# EAGLE design Actuator-MKI-2 (EAGLE 9.6.2)

## Sheet 1 of 2: Part Schematics
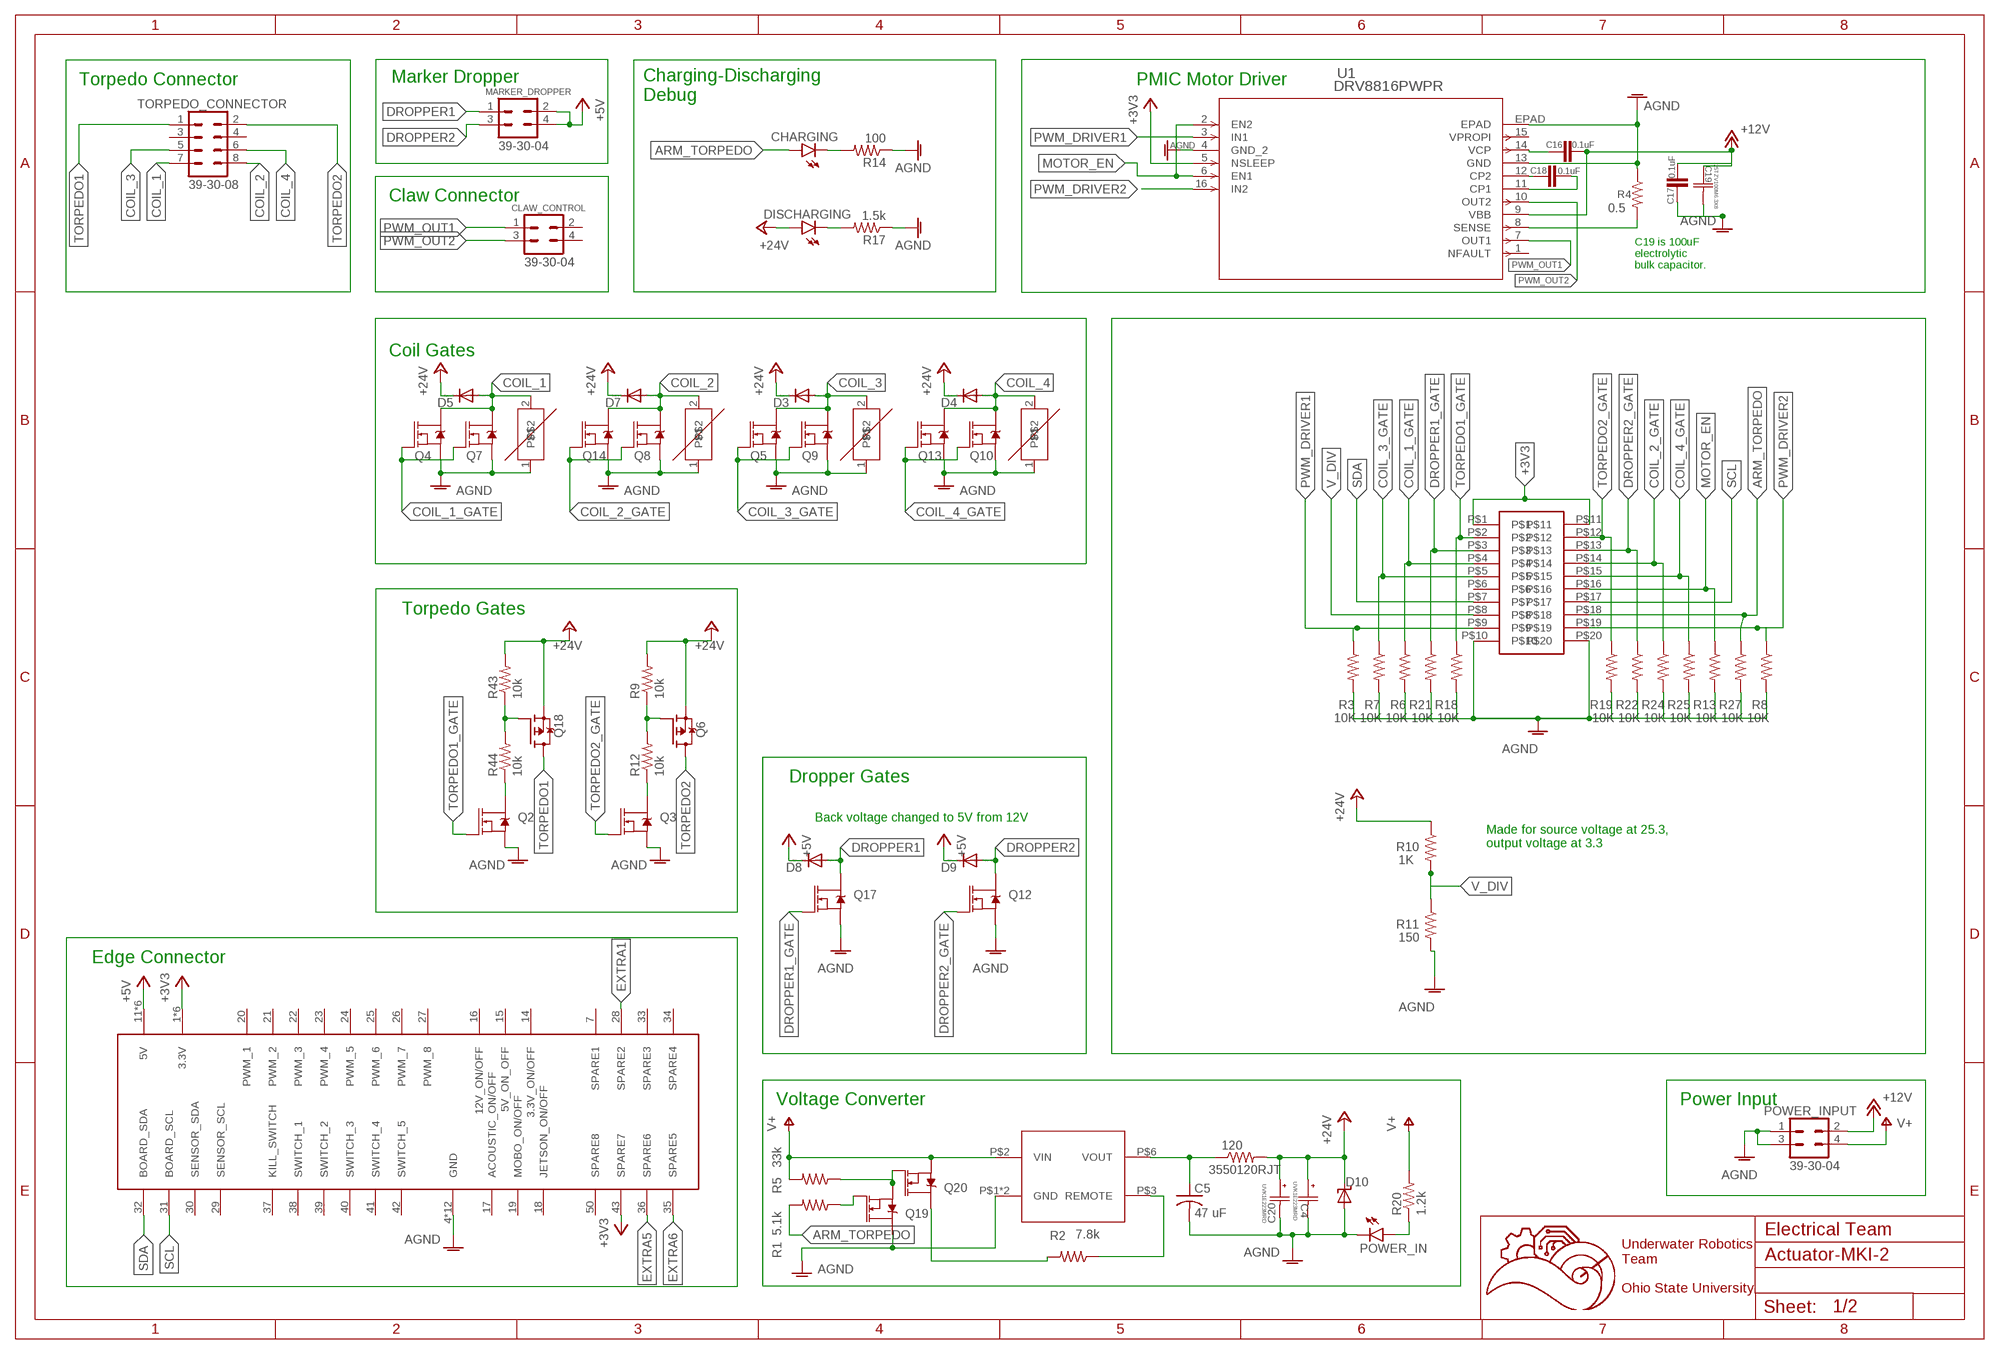
[diagram p0: schematic, sheet 1]

### Parts
120  3550120RJT  [3550120RJT]
C4  UVK1E223MRD  [CAP_UFW_25X50_NCH]
C5  47 uF  C-USC1206K  [C1206K]
C16  0.1uF  C-EUC0603  [C0603]
C17  0.1uF  C-EUC0603  [C0603]
C18  0.1uF  C-EUC0603  [C0603]
C19  25TZV100M6.3X8  [CAP_J-V_6P3X8_RUB]
C20  UVK1E223MRD  [CAP_UFW_25X50_NCH]
CHARGING  LEDCHIPLED_0603  [CHIPLED_0603]
CLAW_CONTROL  39-30-04  [39-30-?04?]
D3  DIODE-SMB  [SMB]
D4  DIODE-SMB  [SMB]
D5  DIODE-SMB  [SMB]
D7  DIODE-SMB  [SMB]
D8  DIODE-SMB  [SMB]
D9  DIODE-SMB  [SMB]
D10  SUPPRESSOR-SMBJ  [SMBJ]
DISCHARGING  LEDCHIPLED_0603  [CHIPLED_0603]
MARKER_DROPPER  39-30-04  [39-30-?04?]
POWER_IN  LEDCHIPLED_0603  [CHIPLED_0603]
POWER_INPUT  39-30-04  [39-30-?04?]
Q2  MOSFET-NCH-AO3404A  [SOT23-3]
Q3  MOSFET-NCH-AO3404A  [SOT23-3]
Q4  MOSFET-NCH-AO3404A  [SOT23-3]
Q5  MOSFET-NCH-AO3404A  [SOT23-3]
Q6  FDD4141TO252  [TO252]
Q7  MOSFET-NCH-AO3404A  [SOT23-3]
Q8  MOSFET-NCH-AO3404A  [SOT23-3]
Q9  MOSFET-NCH-AO3404A  [SOT23-3]
Q10  MOSFET-NCH-AO3404A  [SOT23-3]
Q12  MOSFET-NCH-AO3404A  [SOT23-3]
Q13  MOSFET-NCH-AO3404A  [SOT23-3]
Q14  MOSFET-NCH-AO3404A  [SOT23-3]
Q17  MOSFET-NCH-AO3404A  [SOT23-3]
Q18  FDD4141TO252  [TO252]
Q19  MOSFET-NCH-AO3404A  [SOT23-3]
Q20  MOSFET-NCH-AO3404A  [SOT23-3]
R1  5.1k  R-US_R0603  [R0603]
R2  7.8k  R-US_R0603  [R0603]
R3  10K  R-US_R0603  [R0603]
R4  0.5  R-US_R0805  [R0805]
R5  33k  R-US_R0603  [R0603]
R6  10K  R-US_R0603  [R0603]
R7  10K  R-US_R0603  [R0603]
R8  10K  R-US_R0603  [R0603]
R9  10k  R-US_R0603  [R0603]
R10  1K  R-US_R0603  [R0603]
R11  150  R-US_R0603  [R0603]
R12  10k  R-US_R0603  [R0603]
R13  10K  R-US_R0603  [R0603]
R14  100  R-US_R0805  [R0805]
R17  1.5k  R-US_R0805  [R0805]
R18  10K  R-US_R0603  [R0603]
R19  10K  R-US_R0603  [R0603]
R20  1.2k  R-US_R0805  [R0805]
R21  10K  R-US_R0603  [R0603]
R22  10K  R-US_R0603  [R0603]
R24  10K  R-US_R0603  [R0603]
R25  10K  R-US_R0603  [R0603]
R27  10K  R-US_R0603  [R0603]
R43  10k  R-US_R0603  [R0603]
R44  10k  R-US_R0603  [R0603]
TORPEDO_CONNECTOR  39-30-08  [39-30-?08?]
U1  DRV8816PWPR  [PWP_16]
U$1  5530843-EDGE  [5530843-6-BOARDFINGERS]
U$4  ERZ-VF2M270ERZ-VF2M270  [RESM8060X320N]
U$5  ERZ-VF2M270ERZ-VF2M270  [RESM8060X320N]
U$6  TMR6-2415  [TMR6-2415]
U$7  ERZ-VF2M270ERZ-VF2M270  [RESM8060X320N]
U$8  ERZ-VF2M270ERZ-VF2M270  [RESM8060X320N]
U$9  JTAG-SMD  [JTAG-SMD]

### Nets
+3V3: U1.5(NSLEEP) U$1.1(3.3V) U$1.2(3.3V) U$1.3(3.3V) U$1.43(SPARE7) U$1.54(3.3V) U$1.55(3.3V) U$1.56(3.3V) U$9.P$1 U$9.P$11
+5V: D8.C D9.C MARKER_DROPPER.2 MARKER_DROPPER.4 U$1.11(5V) U$1.12(5V) U$1.13(5V) U$1.44(5V) U$1.45(5V) U$1.46(5V)
+12V: C16.2 C17.2 C19.1 POWER_INPUT.2 U1.9(VBB)
+24V: 120.P$2 C4.1 C20.1 D3.C D4.C D5.C D7.C D10.C DISCHARGING.A Q6.2(S) Q18.2(S) R9.2 R10.1 R43.2
AGND: C4.2 C5.2 C17.1 C19.2 C20.2 D10.A POWER_IN.C POWER_INPUT.1 POWER_INPUT.3 Q2.2(S) Q3.2(S) Q4.2(S) Q5.2(S) Q7.2(S) Q8.2(S) Q9.2(S) Q10.2(S) Q12.2(S) Q13.2(S) Q14.2(S) Q17.2(S) Q19.3(D) R3.2 R4.1 R6.2 R7.2 R8.2 R11.2 R13.2 R14.1 R17.1 R18.2 R19.2 R21.2 R22.2 R24.2 R25.2 R27.2 U1.4(GND_2) U1.13(GND) U1.EPAD U$1.4(GND) U$1.5(GND) U$1.6(GND) U$1.8(GND) U$1.9(GND) U$1.10(GND) U$1.47(GND) U$1.48(GND) U$1.49(GND) U$1.51(GND) U$1.52(GND) U$1.53(GND) U$4.1 U$5.1 U$6.P$1(GND) U$6.P$7(GND) U$7.1 U$8.1 U$9.P$10 U$9.P$20
ARM_TORPEDO: CHARGING.A R1.2 R27.1 U$9.P$18
COIL_1: D5.A Q4.3(D) Q7.3(D) TORPEDO_CONNECTOR.7 U$8.2
COIL_1_GATE: Q4.1(G) Q7.1(G) R6.1 U$9.P$4
COIL_2: D7.A Q8.3(D) Q14.3(D) TORPEDO_CONNECTOR.8 U$7.2
COIL_2_GATE: Q8.1(G) Q14.1(G) R24.1 U$9.P$14
COIL_3: D3.A Q5.3(D) Q9.3(D) TORPEDO_CONNECTOR.5 U$5.2
COIL_3_GATE: Q5.1(G) Q9.1(G) R7.1 U$9.P$5
COIL_4: D4.A Q10.3(D) Q13.3(D) TORPEDO_CONNECTOR.6 U$4.2
COIL_4_GATE: Q10.1(G) Q13.1(G) R25.1 U$9.P$15
DROPPER1: D8.A MARKER_DROPPER.1 Q17.3(D)
DROPPER1_GATE: Q17.1(G) R21.1 U$9.P$3
DROPPER2: D9.A MARKER_DROPPER.3 Q12.3(D)
DROPPER2_GATE: Q12.1(G) R22.1 U$9.P$13
EXTRA1: U$1.28(SPARE2)
EXTRA5: U$1.36(SPARE6)
EXTRA6: U$1.35(SPARE5)
MOTOR_EN: R13.1 U1.2(EN2) U1.6(EN1) U$9.P$16
N$2: C16.1 U1.14(VCP)
N$3: R2.1 U$6.P$3(REMOTE)
N$4: CHARGING.C R14.2
N$5: Q19.1(G) R1.1
N$6: Q19.2(S) Q20.1(G) R5.1
N$7: Q20.3(D) R2.2
N$10: POWER_IN.A R20.1
N$15: DISCHARGING.C R17.2
N$26: 120.P$1 C5.1 U$6.P$6(VOUT)
N$33: Q18.1(G) R43.1 R44.2
N$34: Q2.3(D) R44.1
N$35: Q6.1(G) R9.1 R12.2
N$36: Q3.3(D) R12.1
N$45: R4.2 U1.8(SENSE)
N$48: C18.2 U1.11(CP1)
N$49: C18.1 U1.12(CP2)
PWM_DRIVER1: R3.1 U1.3(IN1) U$9.P$9
PWM_DRIVER2: R8.1 U1.16(IN2) U$9.P$19
PWM_OUT1: CLAW_CONTROL.1 U1.7(OUT1)
PWM_OUT2: CLAW_CONTROL.3 U1.10(OUT2)
SCL: U$1.31(BOARD_SCL) U$9.P$17
SDA: U$1.32(BOARD_SDA) U$9.P$7
TORPEDO1: Q18.3(D) TORPEDO_CONNECTOR.1
TORPEDO1_GATE: Q2.1(G) R18.1 U$9.P$2
TORPEDO2: Q6.3(D) TORPEDO_CONNECTOR.2
TORPEDO2_GATE: Q3.1(G) R19.1 U$9.P$12
V+: POWER_INPUT.4 Q20.2(S) R5.2 R20.2 U$6.P$2(VIN)
V_DIV: R10.2 R11.1 U$9.P$8
Unconnected: CLAW_CONTROL.2 CLAW_CONTROL.4 TORPEDO_CONNECTOR.3 TORPEDO_CONNECTOR.4 U1.1(NFAULT) U1.15(VPROPI) U$1.7(SPARE1) U$1.14(3.3V_ON/OFF) U$1.15(5V_ON_OFF) U$1.16(12V_ON/OFF) U$1.17(ACOUSTIC_ON/OFF) U$1.18(JETSON_ON/OFF) U$1.19(MOBO_ON/OFF) U$1.20(PWM_1) U$1.21(PWM_2) U$1.22(PWM_3) U$1.23(PWM_4) U$1.24(PWM_5) U$1.25(PWM_6) U$1.26(PWM_7) U$1.27(PWM_8) U$1.29(SENSOR_SCL) U$1.30(SENSOR_SDA) U$1.33(SPARE3) U$1.34(SPARE4) U$1.37(KILL_SWITCH) U$1.38(SWITCH_1) U$1.39(SWITCH_2) U$1.40(SWITCH_3) U$1.41(SWITCH_4) U$1.42(SWITCH_5) U$1.50(SPARE8) U$9.P$6

### Notes on the sheet
- Torpedo Connector | Marker Dropper | PMIC Motor Driver
- Charging-Discharging 
  Debug
- Claw Connector
- C19 is 100uF
  electrolytic
  bulk capacitor.
- Coil Gates
- Torpedo Gates
- Dropper Gates
- Back voltage changed to 5V from 12V
- Made for source voltage at 25.3, 
  output voltage at 3.3
- Edge Connector
- Voltage Converter | Power Input
- Electrical Team
- Underwater Robotics
  Team
  
  Ohio State University

## Sheet 2 of 2: Notes
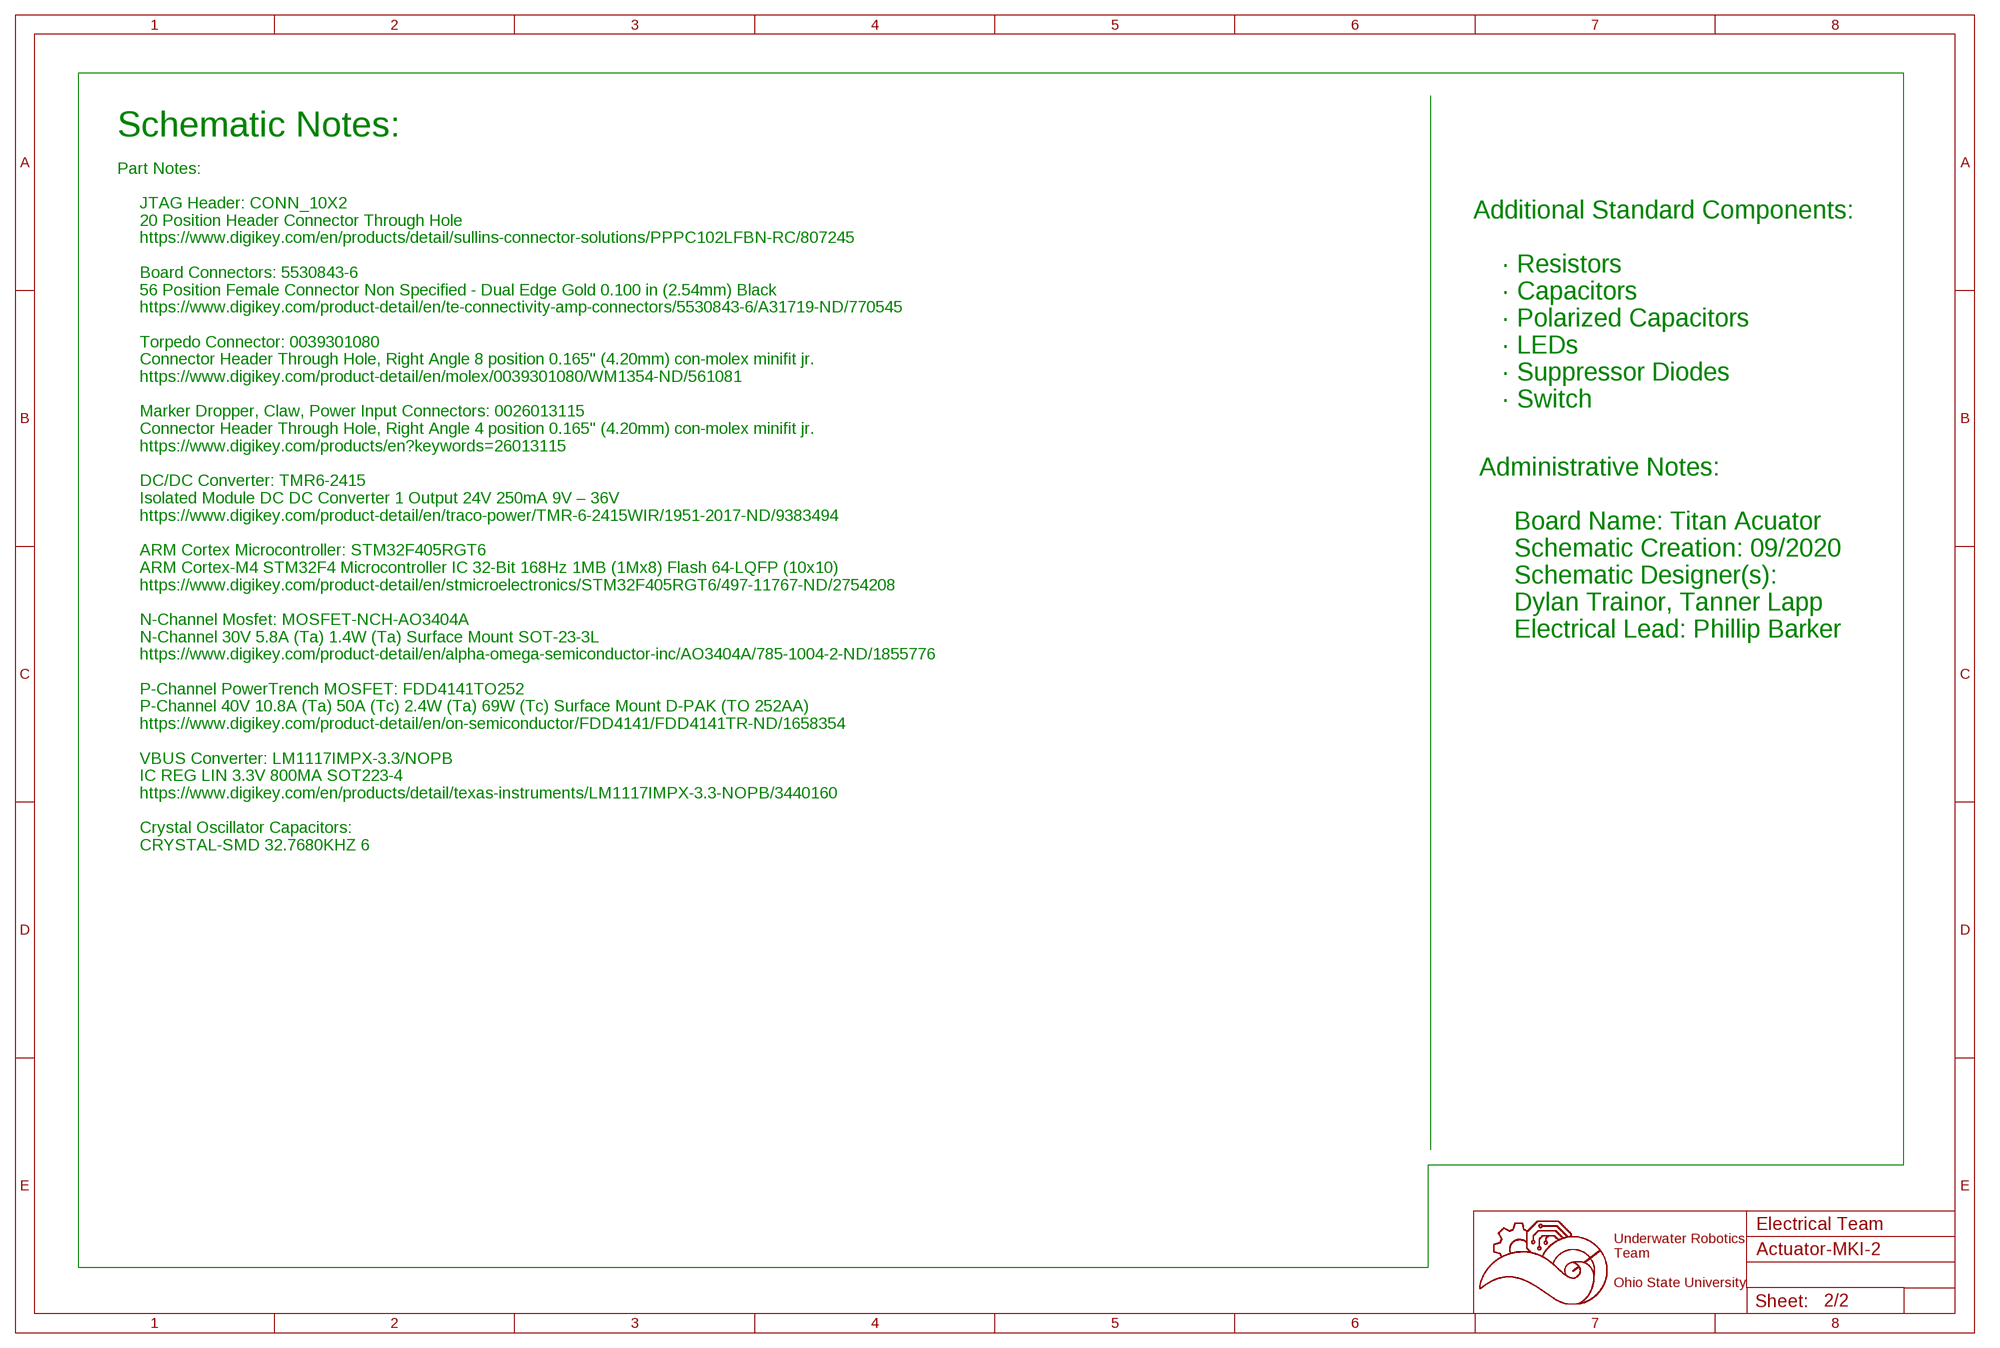
[diagram p1: schematic, sheet 2]

### Notes on the sheet
- Schematic Notes:
- Part Notes:
  
       JTAG Header: CONN_10X2
       20 Position Header Connector Through Hole 
       https://www.digikey.com/en/products/detail/sullins-connector-solutions/PPPC102LFBN-RC/807245
    
       Board Connectors: 5530843-6 
       56 Position Female Connector Non Specified - Dual Edge Gold 0.100 in (2.54mm) Black 
       https://www.digikey.com/product-detail/en/te-connectivity-amp-connectors/5530843-6/A31719-ND/770545 
    
       Torpedo Connector: 0039301080 
       Connector Header Through Hole, Right Angle 8 position 0.165" (4.20mm) con-molex minifit jr. 
       https://www.digikey.com/product-detail/en/molex/0039301080/WM1354-ND/561081 
    
       Marker Dropper, Claw, Power Input Connectors: 0026013115 
       Connector Header Through Hole, Right Angle 4 position 0.165" (4.20mm) con-molex minifit jr. 
       https://www.digikey.com/products/en?keywords=26013115 
    
       DC/DC Converter: TMR6-2415 
       Isolated Module DC DC Converter 1 Output 24V 250mA 9V – 36V 
       https://www.digikey.com/product-detail/en/traco-power/TMR-6-2415WIR/1951-2017-ND/9383494 
    
       ARM Cortex Microcontroller: STM32F405RGT6 
       ARM Cortex-M4 STM32F4 Microcontroller IC 32-Bit 168Hz 1MB (1Mx8) Flash 64-LQFP (10x10) 
       https://www.digikey.com/product-detail/en/stmicroelectronics/STM32F405RGT6/497-11767-ND/2754208 
    
       N-Channel Mosfet: MOSFET-NCH-AO3404A 
       N-Channel 30V 5.8A (Ta) 1.4W (Ta) Surface Mount SOT-23-3L 
       https://www.digikey.com/product-detail/en/alpha-omega-semiconductor-inc/AO3404A/785-1004-2-ND/1855776 
    
       P-Channel PowerTrench MOSFET: FDD4141TO252 
       P-Channel 40V 10.8A (Ta) 50A (Tc) 2.4W (Ta) 69W (Tc) Surface Mount D-PAK (TO 252AA) 
       https://www.digikey.com/product-detail/en/on-semiconductor/FDD4141/FDD4141TR-ND/1658354
  
       VBUS Converter: LM1117IMPX-3.3/NOPB
       IC REG LIN 3.3V 800MA SOT223-4
       https://www.digikey.com/en/products/detail/texas-instruments/LM1117IMPX-3.3-NOPB/3440160
    
       Crystal Oscillator Capacitors: 
       CRYSTAL-SMD 32.7680KHZ 6PF  3.2X1.5MM 
       https://www.digikey.com/en/products/detail/micro-crystal-ag/CM7V-T1A-32-768KHZ-6PF-20PPM-TA-QC/10499118
       CRYSTAL-16MHZPTH-HC49US (CRYSTAL-16MHZ)
       https://www.digikey.com/en/products/detail/abracon-llc/ABM3B-16-000MHZ-B2-T/675317?s=N4IgTCBcDaIKwGY4FoCcBGMZnuQOQBEQBdAXyA 
  
       ERZ-VF2M270 Varistor
       VARISTOR 27V 125A 2SMD JLEAD
       https://www.digikey.com/en/products/detail/panasonic-electronic-components/ERZ-VF2M270/672899
  
       3550120RJT Resistor
       RES 3550 120 Ohm 5% 5W
       https://www.digikey.com/en/products/detail/te-connectivity-passive-product/3550120RJT/9927251
  
       DRV8816PWPR Motor Driver
       IC MOTOR DRIVER 8V-38V 16HTSSOP
       https://www.digikey.com/en/products/detail/texas-instruments/DRV8816PWPR/4439658
  
       25TZV100M6.3X8 Electrolytic Capacitor
       CAP ALUM 100UF 20% 25V SMD
       https://www.digikey.com/en/products/detail/rubycon/25TZV100M6-3X8/3134865
  
       UVK1E223MRD 22mF Capacitor
       CAP ALUM 22000UF 20% 25V RADIAL
       https://www.digikey.com/en/products/detail/nichicon/UVK1E223MRD/2539394
- Additional Standard Components:
  
       · Resistors 
       · Capacitors 
       · Polarized Capacitors 
       · LEDs 
       · Suppressor Diodes 
       · Switch
- Administrative Notes:
  
       Board Name: Titan Acuator
       Schematic Creation: 09/2020
       Schematic Designer(s): 
       Dylan Trainor, Tanner Lapp
       Electrical Lead: Phillip Barker
- Electrical Team
- Underwater Robotics
  Team
  
  Ohio State University

## Library data of the parts
120 = 3550120RJT:3550120RJT
C4 C20 = UVK1E223MRD:UVK1E223MRD; BUILT_BY: EMA_Cory; COPYRIGHT: Copyright (C) 2018 Accelerated Designs. All rights reserved; MANUFACTURER_PART_NUMBER: UVK1E223MRD; SOURCELIBRARY: Nichicon_2019-09-13; VENDOR: Nichicon
C5 = resistor:C-US: CAPACITOR, American symbol
C16-C18 = rcl:C-EU: CAPACITOR, European symbol; SPICEPREFIX: C
C19 = 25TZV100M6_3X8:25TZV100M6.3X8; BUILT_BY: EMA_Cory; COPYRIGHT: Copyright (C) 2018 Accelerated Designs. All rights reserved; MANUFACTURER_PART_NUMBER: 25TZV100M6.3X8; SOURCELIBRARY: Rubycon_2019-09-19; VENDOR: Rubycon Netherlands
CHARGING DISCHARGING POWER_IN = led:LED: LED OSRAM: - CHIPLED LG R971, LG N971, LY N971, LG Q971, LY Q971, LO R971, LY R971 LH N974, LH R974 LS Q976, LO Q976, LY Q976 LO Q996 - Hyper CHIPLED LW Q18S LB Q993, LB Q99A, LB R99A - SideLED LS A670, LO A670, LY A670, LG A670, LP A670 LB A673, LV A673, LT A673, LW A673 LH A674 LY A675 LS A676, LA A676, LO A676, LY A676, LW A676 LS A679, LY A679, LG A679 - Hyper Micro SIDELED® LS Y876, LA Y876, LO Y876, LY Y876 LT Y87S - SmartLED LW L88C, LW L88S LB L89C, LB L89S, LG L890 LS L89K, LO L89K, LY L89K LS L896, LA L896, LO L896, LY L896 - TOPLED LS T670, LO T670, LY T670, LG T670, LP T670 LSG T670, LSP T670, LSY T670, LOP T670, LYG T670 LG T671, LOG T671, LSG T671 LB T673, LV T673, LT T673, LW T673 LH T674 LS T676, LA T676, LO T676, LY T676, LB T676, LH T676, LSB T676, LW T676 LB T67C, LV T67C, LT T67C, LS T67K, LO T67K, LY T67K, LW E67C LS E67B, LA E67B, LO E67B, LY E67B, LB E67C, LV E67C, LT E67C LW T67C LS T679, LY T679, LG T679 LS T770, LO T770, LY T770, LG T770, LP T770 LB T773, LV T773, LT T773, LW T773 LH T774 LS E675, LA E675, LY E675, LS T675 LS T776, LA T776, LO T776, LY T776, LB T776 LHGB T686 LT T68C, LB T68C - Hyper Mini TOPLED® LB M676 - Mini TOPLED Santana® LG M470 LS M47K, LO M47K, LY M47K Source: http://www.osram.convergy.de LUXEON: - LUMILED® LXK2-PW12-R00, LXK2-PW12-S00, LXK2-PW14-U00, LXK2-PW14-V00 LXK2-PM12-R00, LXK2-PM12-S00, LXK2-PM14-U00 LXK2-PE12-Q00, LXK2-PE12-R00, LXK2-PE12-S00, LXK2-PE14-T00, LXK2-PE14-U00 LXK2-PB12-K00, LXK2-PB12-L00, LXK2-PB12-M00, LXK2-PB14-N00, LXK2-PB14-P00, LXK2-PB14-Q00 LXK2-PR12-L00, LXK2-PR12-M00, LXK2-PR14-Q00, LXK2-PR14-R00 LXK2-PD12-Q00, LXK2-PD12-R00, LXK2-PD12-S00 LXK2-PH12-R00, LXK2-PH12-S00 LXK2-PL12-P00, LXK2-PL12-Q00, LXK2-PL12-R00 Source: www.luxeon.com KINGBRIGHT: KA-3528ASYC Source: www.kingbright.com
CLAW_CONTROL MARKER_DROPPER POWER_INPUT = con-molex-mini-fit:39-30-?04?: HEADER
D3-D5 D7-D9 = diode:DIODE-: DIODE
D10 = diode:SUPPRESSOR-: Suppressor diode
Q2-Q5 Q7-Q10 Q12-Q14 Q17 Q19 Q20 = SparkFun-DiscreteSemi:MOSFET-NCH: N-channel MOSFETs Voltage controlled devices that allow control of high current outputs. SparkFun Products: SparkFun OpenScale <https://www.sparkfun.com/products/13261> SparkFun Digital Sandbox <https://www.sparkfun.com/products/12651> SparkFun Monster Moto Shield <https://www.sparkfun.com/products/10182> SparkFun MOSFET Power Controller <https://www.sparkfun.com/products/11214>; PROD_ID: TRANS-12988; VALUE: 5.8A/30V/35mΩ
Q6 Q18 = transistor-fet:FDD4141: P-Channel PowerTrench® MOSFET Source: FDD4141.pdf
R1-R14 R17-R22 R24 R25 R27 R43 R44 = resistor:R-US_: RESISTOR, American symbol
TORPEDO_CONNECTOR = con-molex-mini-fit:39-30-?08?: HEADER
U1 = DRV8816POWPR:DRV8816PWPR; MANUFACTURER_PART_NUMBER: DRV8816PWPR; VENDOR: Texas Instruments
U$1 = 5530843-6:5530843-EDGE
U$4 U$5 U$7 U$8 = ERZ-VF2M270:ERZ-VF2M270
U$6 = converter:TMR6-2415
U$9 = JTAG-SMD:JTAG-SMD

## Board
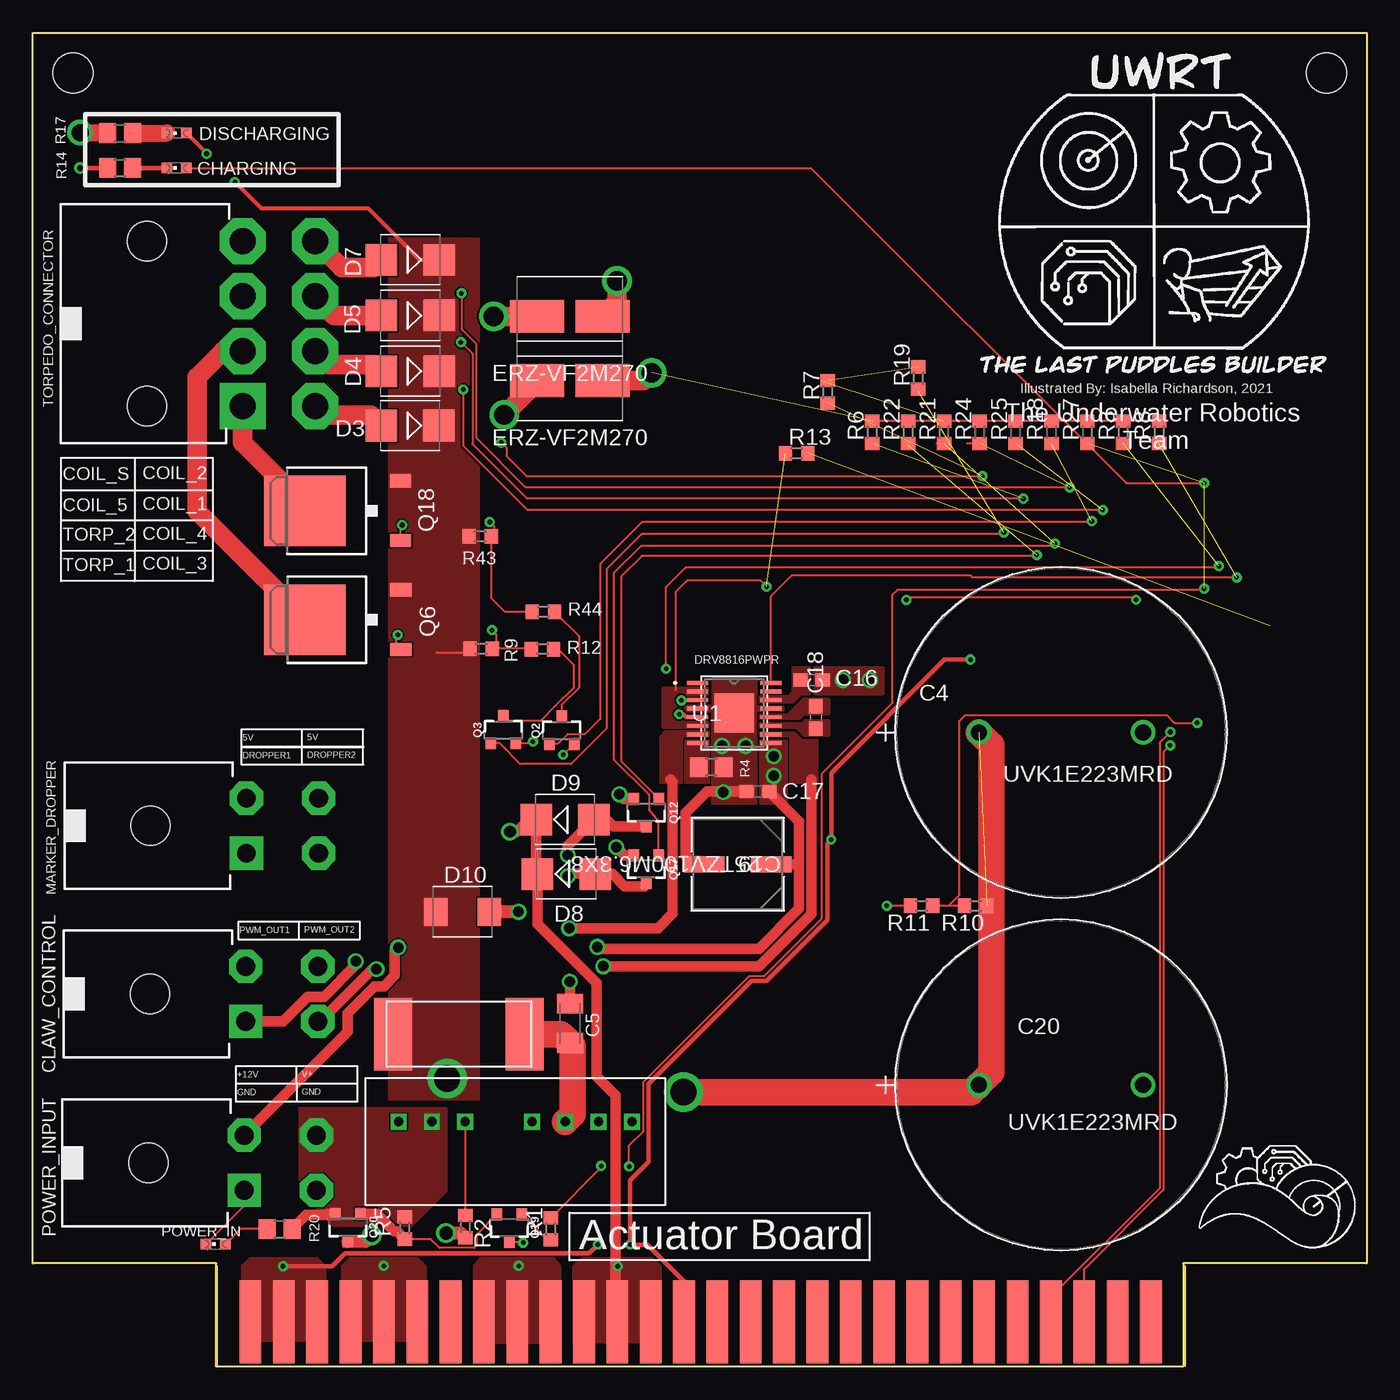
[diagram p2: board, top side]
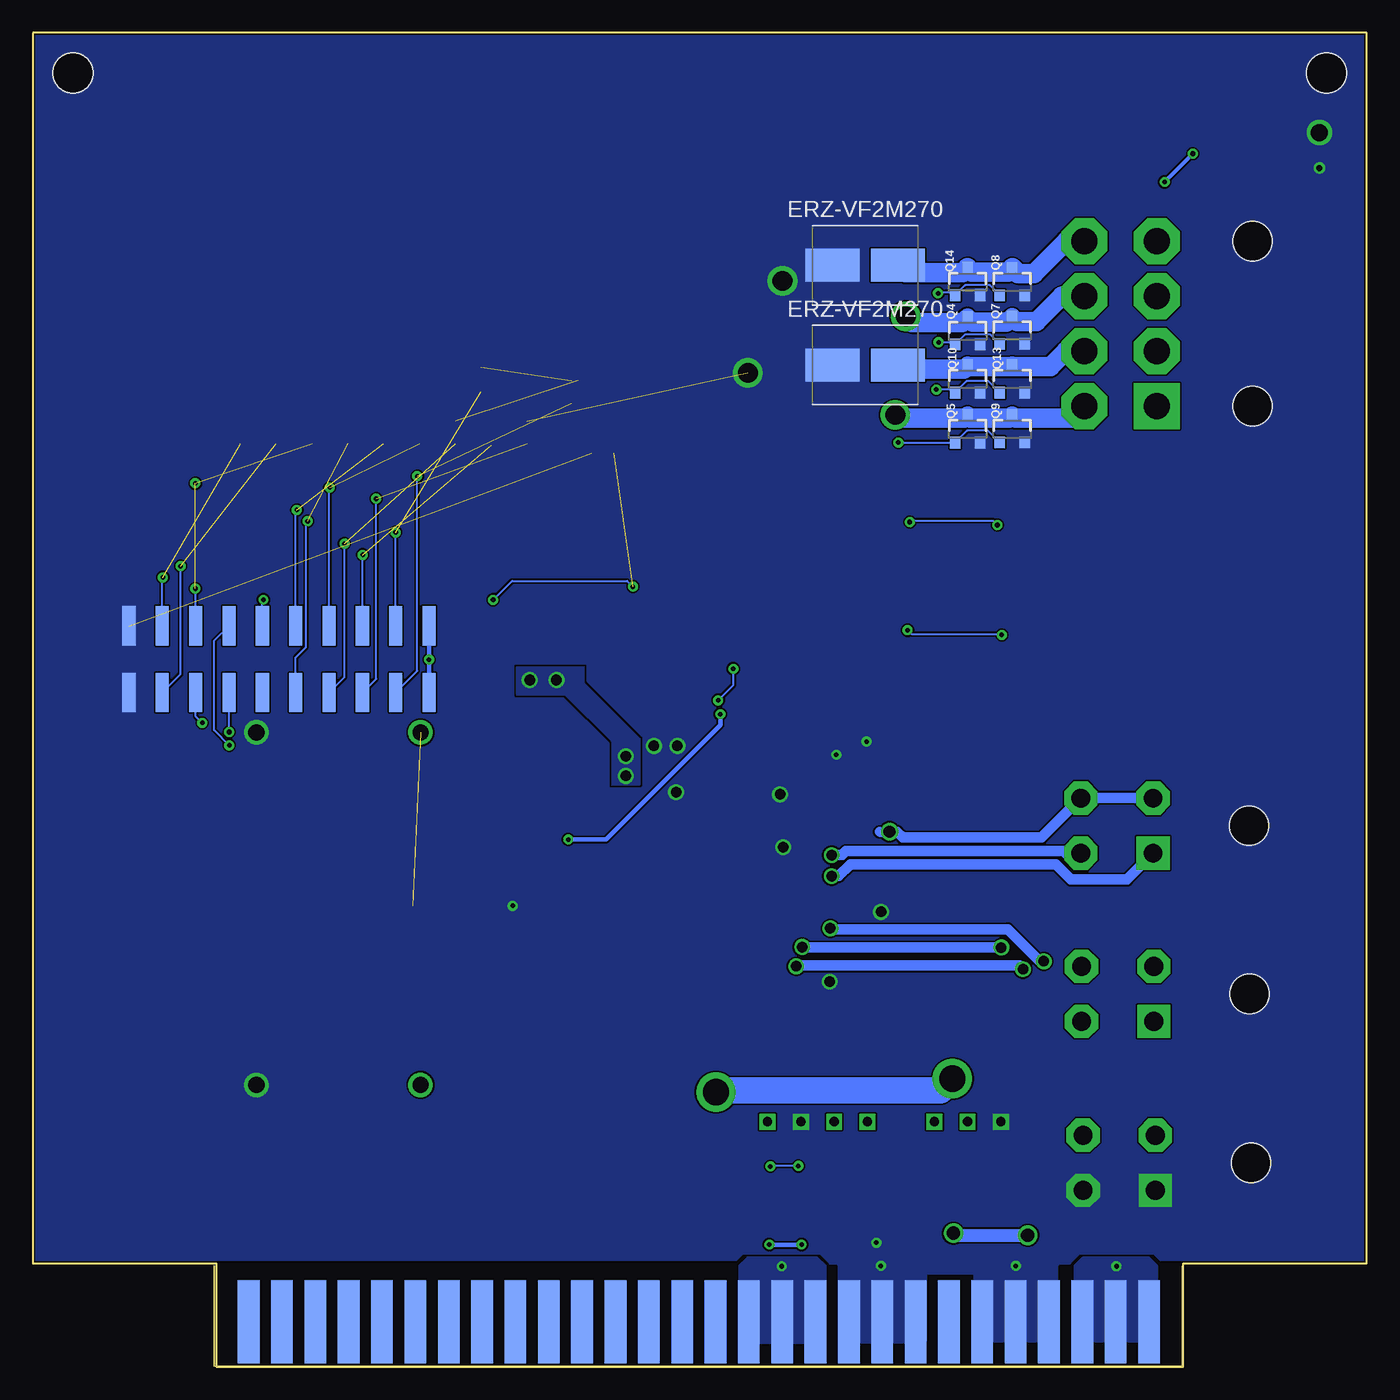
[diagram p3: board, bottom side, seen from below]

Size 101.6 x 101.6 mm. Coordinates in mm from the lower left corner, seen from the top.
Outline: 13.97,0 13.97,7.87 0,7.87 0,101.6 101.6,101.6 101.6,7.87 87.63,7.87 87.63,0 13.97,0
Copper layers (1*16): Top 0.035mm / dielectric 1.5mm / Bottom 0.035mm
Design rules "default *": minimum track width 6mil, minimum drill 0.35mm, track to track 5mil, track to pad 8mil, pad to pad 5mil, via to via 10mil, smd to smd 2mil, copper to edge 0mil, drill to drill 6mil, minimum pad ring 10mil, minimum via ring 8mil, stop-mask expansion 4mil, vias tented up to drill 0mil, thermal gap 10mil
Holes 3.05 mm at 3.05,98.55 98.55,98.55

### Footprints (pad centres in the part's own frame; a part is rotated, then mirrored left to right if it is on the bottom)
3550120RJT = smd 2.896 x 5.499: P$1 -5,0; P$2 5,0
CAP_UFW_25X50_NCH = drill 1.245 pad 1.753: 1 0,0; 2 12.497,0
C1206K = smd 1.5 x 2: 1 -1.5,0; 2 1.5,0
C0603 = smd 1.1 x 1: 1 -0.85,0; 2 0.85,0
CAP_J-V_6P3X8_RUB = smd 3.099 x 1.219: 1 -2.553,0; 2 2.553,0
CHIPLED_0603 = smd 0.8 x 0.8: A 0,-0.75; C 0,0.75
39-30-?04? = drill 1.422 pad 2.54 square: 1 2.095,0 | drill 1.422 pad 2.54 octagon: 2 -2.095,0; 3 2.095,5.512; 4 -2.095,5.512 | hole 3: 0,-7.3
SMB = smd 2.4 x 2.4: A 2.2,0; C -2.2,0
SMBJ = smd 1.78 x 2.16: A 2.04,0; C -2.03,0
SOT23-3 = smd 0.8 x 0.9: 1 -0.95,-1; 2 0.95,-1; 3 0,1.1
TO252 = smd 1 x 1.6: 1 -2.28,-4.8; 2 2.28,-4.8 | smd 5.4 x 6.2: 3 0,2.5
R0603 = smd 1 x 1.1: 1 -0.85,0; 2 0.85,0
R0805 = smd 1.3 x 1.5: 1 -0.95,0; 2 0.95,0
39-30-?08? = drill 2 pad 3.5 square: 1 6.287,0 | drill 2 pad 3.5 octagon: 2 2.095,0; 3 -2.095,0; 4 -6.287,0; 5 6.287,5.512; 6 2.095,5.512; 7 -2.095,5.512; 8 -6.287,5.512 | hole 3: -6.287,-7.3; 6.287,-7.3
PWP_16 = smd 1.6 x 0.3: 1 -2.8,2.275; 2 -2.8,1.625; 3 -2.8,0.975; 4 -2.8,0.325; 5 -2.8,-0.325; 6 -2.8,-0.975; 7 -2.8,-1.625; 8 -2.8,-2.275; 9 2.8,-2.275; 10 2.8,-1.625; 11 2.8,-0.975; 12 2.8,-0.325; 13 2.8,0.325; 14 2.8,0.975; 15 2.8,1.625; 16 2.8,2.275 | smd 3 x 3: EPAD 0,0
5530843-6-BOARDFINGERS = smd 1.651 x 6.35 bottom: 1 0.826,3.375; 2 3.365,3.375; 3 5.905,3.375; 4 8.445,3.375; 5 10.986,3.375; 6 13.525,3.375; 7 16.066,3.375; 8 18.605,3.375; 9 21.145,3.375; 10 23.686,3.375; 11 26.226,3.375; 12 28.765,3.375; 13 31.305,3.375; 14 33.846,3.375; 15 36.386,3.375; 16 38.925,3.375; 17 41.465,3.375; 18 44.005,3.375; 19 46.545,3.375; 20 49.086,3.375; 21 51.626,3.375; 22 54.166,3.375; 23 56.706,3.375; 24 59.245,3.375; 25 61.785,3.375; 26 64.326,3.375; 27 66.865,3.375; 28 69.406,3.375 | smd 1.651 x 6.35: 29 69.406,3.375; 30 66.865,3.375; 31 64.326,3.375; 32 61.785,3.375; 33 59.245,3.375; 34 56.706,3.375; 35 54.166,3.375; 36 51.626,3.375; 37 49.086,3.375; 38 46.545,3.375; 39 44.005,3.375; 40 41.465,3.375; 41 38.925,3.375; 42 36.386,3.375; 43 33.846,3.375; 44 31.305,3.375; 45 28.765,3.375; 46 26.226,3.375; 47 23.686,3.375; 48 21.145,3.375; 49 18.605,3.375; 50 16.066,3.375; 51 13.525,3.375; 52 10.986,3.375; 53 8.445,3.375; 54 5.905,3.375; 55 3.365,3.375; 56 0.826,3.375
RESM8060X320N = smd 4.11 x 2.5: 1 -2.495,0; 2 2.495,0
TMR6-2415 = drill 0.7 square: P$1 0,0; P$2 2.54,0; P$3 5.08,0; P$5 10.16,0; P$6 12.7,0; P$7 15.24,0; P$8 17.78,0
JTAG-SMD = smd 3 x 1: P$1 -2.54,11.43; P$2 2.54,1.27; P$3 2.54,3.81; P$4 2.54,6.35; P$5 2.54,8.89; P$6 2.54,-1.27; P$7 2.54,-3.81; P$8 2.54,-6.35; P$9 2.54,-8.89; P$10 2.54,-11.43; P$11 2.54,11.43; P$12 -2.54,8.89; P$13 -2.54,6.35; P$14 -2.54,3.81; P$15 -2.54,1.27; P$16 -2.54,-1.27; P$17 -2.54,-3.81; P$18 -2.54,-6.35; P$19 -2.54,-8.89; P$20 -2.54,-11.43

### Placement (x,y rotation side)
120  32.46,25.33 180 top
C4  72.07,48.31 0 top
C5  40.92,26.16 90 top
C16  59.32,52.3 0 top
C17  55.23,43.82 0 top
C18  59.63,49.45 270 top
C19  53.69,38.27 180 top
C20  72.07,21.46 0 top
CHARGING  10.95,91.31 90 top
CLAW_CONTROL  39-30-04?  [39-30-?04?]  16.21,28.4 270 top
D3  28.74,71.68 180 top
D4  28.76,75.82 180 top
D5  28.75,80.08 180 top
D7  28.76,84.32 180 top
D8  40.64,37.53 0 top
D9  40.54,41.67 0 top
D10  32.73,34.64 0 top
DISCHARGING  10.95,93.96 90 top
MARKER_DROPPER  39-30-04?  [39-30-?04?]  16.26,41.2 270 top
POWER_IN  13.92,9.33 90 top
POWER_INPUT  39-30-04?  [39-30-?04?]  16.1,15.53 270 top
Q2  40.28,48.44 0 top
Q3  35.84,48.49 0 top
Q4  30.4,78.87 0 bottom
Q5  30.4,71.39 0 bottom
Q6  23.23,56.89 90 top
Q7  27,78.9 0 bottom
Q8  27,82.6 0 bottom
Q9  27,71.4 0 bottom
Q10  30.4,75.2 0 bottom
Q12  46.72,42.24 180 top
Q13  27,75.21 0 bottom
Q14  30.4,82.61 0 bottom
Q17  46.72,37.94 180 top
Q18  23.23,65.19 90 top
Q19  36.29,10.6 180 top
Q20  24.01,10.63 180 top
R1  39.46,10.5 90 top
R2  32.95,10.67 270 top
R3  83.06,71.17 90 top
R4  51.68,45.67 180 top
R5  28.33,10.57 90 top
R6  63.94,71.17 90 top
R7  60.56,74.25 90 top
R8  85.79,71.17 90 top
R9  34.16,54.67 180 top
R10  71.82,35.1 180 top
R11  67.69,35.1 180 top
R12  38.82,54.66 180 top
R13  58.18,69.57 0 top
R14  6.64,91.31 0 top
R17  6.64,93.96 0 top
R18  77.59,71.17 90 top
R19  67.45,75.3 90 top
R20  18.8,10.49 0 top
R21  69.4,71.17 90 top
R22  66.67,71.17 90 top
R24  72.13,71.17 90 top
R25  74.86,71.17 90 top
R27  80.32,71.17 90 top
R43  34.07,63.24 180 top
R44  38.88,57.5 180 top
TORPEDO_CONNECTOR  39-30-08?  [39-30-?08?]  15.99,79.45 270 top
U1  53.43,49.79 0 top
U$1  15.76,0.05 0 top
U$4  38.2,76.3 0 bottom
U$5  40.9,75.1 180 top
U$6  27.86,18.66 0 top
U$7  38.2,83.9 0 bottom
U$8  40.9,80 180 top
U$9  82.85,53.89 270 bottom

### Tracks (layer width: path | path; a pad name or v marks a point on that pad's centre or on a via)
+3V3  (via drill 0.35)
  Top 0.152: U$1.43 49.61,3.44
  Top 0.35: 49.61,3.44 49.61,6.49 46.81,9.3 v45.5,9.3 45.5,14.19 46.9,15.59 46.9,21.53 54.76,29.39 55.88,29.39 60.52,34.02 60.52,39.85 v60.81,40.15 60.81,45.23 69.44,53.86 v71.42,53.86 | v19.06,7.65 22.78,7.65 23.77,8.64 42.38,8.64 v43.04,9.3 | v49.23,49.7 49.57,49.7 49.77,49.49 50.6,49.49 U1.5
  Bottom 0.35: v45.5,9.3 v43.04,9.3 | U$9.P$1 v71.42,53.86 U$9.P$11 | v60.81,40.15 57.95,40.15 49.23,48.87 v49.23,49.7
  pour Bottom (no thermals): 15.93,7.67 16.57,8.3 21.65,8.3 22.28,7.67 22.28,1.95 15.93,1.95
  pour Top (no thermals): 15.93,7.67 16.57,8.3 21.65,8.3 22.28,7.67 22.28,1.95 15.93,1.95
+5V  (via drill 0.35, 0.9)
  Top 0.8: U$1.12 44.39,3.56 44.39,20.67 42.93,22.12 42.93,29.24 38.44,33.73 D8.C 38.34,37.63 D9.C 37.78,41.67 36.86,40.75 v36.34,40.75
  Bottom 0.775: 37.1,40.75 v36.34,40.75
  Bottom 0.8: MARKER_DROPPER.2 MARKER_DROPPER.4 24.77,40.3 35.33,40.3 35.78,40.75 v36.34,40.75
  other vias: 44.56,7.65
  pour Top (no thermals): 41.2,1.83 41.2,7.67 41.84,8.3 47.17,8.3 47.81,7.67 47.81,1.83
  pour Bottom (no thermals): 41.2,1.83 41.2,7.67 41.84,8.3 47.17,8.3 47.81,7.67 47.81,1.83
+12V  (via drill 0.8)
  Top 0.8: POWER_INPUT.2 23.99,25.52 23.99,26.91 26.04,28.96 26.74,28.96 27.57,29.79 27.57,31.67 v27.84,31.93 | v42.99,31.96 43.12,31.83 55.3,31.83 58.37,34.9 58.37,38.3 | C17.2 58.37,41.52 58.37,38.3 | C19.1 58.34,38.27 58.37,38.3
  Bottom 0.8: v42.99,31.96 42.96,31.93 v27.84,31.93
  other vias: 56.43,46.49 56.43,45.01 61.71,52.3 63.76,52.3
  pour Top (no thermals): 55.41,42.86 55.41,47.71 57.42,47.71 57.42,42.86
  pour Bottom: 55.34,44.41 55.34,47.78 59.6,52.04 59.6,53.26 64.75,53.26 64.75,51.21 61.05,51.21 57.49,47.65 57.49,44.35 55.41,44.35
  pour Top (no thermals): 59.57,53.29 64.75,53.29 64.79,53.26 64.79,51.25 64.75,51.21 59.57,51.21
+24V  (via drill 0.35, 2)  (1 unrouted)
  Top 0.152: R9.2 33.01,54.37 30.74,54.37 | 30.5,71.24 D3.C
  Top 0.3: DISCHARGING.A 13.24,92.42 v13.24,92.39 | D7.C 29.46,84.32 25.55,88.23 17.4,88.23 v15.39,90.24
  Top 1.5: 30.5,71.72 30.98,71.72 D3.C | D7.C
  Top 1.905: 27.46,24.86 120.P$2 27.46,26.32
  Top 2: D4.C 30.94,75.8 | v49.56,20.92 49.59,20.89 71.47,20.89 72.05,21.46 C20.1 73.02,22.42 73.02,47.35 C4.1 | D3.C
  Bottom 0.3: v13.24,92.39 v15.39,90.24
  Bottom 2: v49.56,20.92 49.44,21.04 32.45,21.04 v31.56,21.93
  pour Top (no thermals): 27.13,85.95 33.94,85.95 33.94,20.31 27.13,20.31
AGND  (via drill 0.35, 0.45, 0.8, 1.3, 1.5)  (4 unrouted)
  Top 0.152: Q3.2 37.98,47.49 v38.1,47.61 | Q2.2 v40.4,46.61 | v36.99,34.65 v36.98,34.64 | 53.1,50.12 U1.EPAD | Q19.3 37.29,9.5 v37.35,9.45 | 67.15,72.03 R6.2 R22.2 R21.2 R24.2 R25.2 R18.2 R27.2 R3.2 R8.2 | R7.2 60.07,75.09 | POWER_IN.C 16.1,12.26 POWER_INPUT.1 | R11.2 v65.05,35.1
  Top 0.35: R14.1 v3.61,91.31 v3.6,91.3
  Top 0.8: Q17.2 45.07,38.94 v44.45,39.56 | v40.9,29.33 40.92,29.31 C5.2 | Q12.2 45.03,43.24 v44.68,43.6 | C17.1 51.35,43.82 49.73,42.19 49.73,38.96 50.17,38.52 50.89,38.52 C19.2
  Top 1: v36.98,34.64 D10.A
  Top 1.3: R17.1 3.64,93.96 v3.6,94
  Top 1.5: U$8.1 44.5,81.11 v44.5,82.7 | U$5.1 46.53,75.1 v47.13,75.7
  other vias: 26.73,7.67 37.01,7.67 52.5,47.28 54.28,47.28 52.6,43.75
  pour Top (no thermals): 23.55,7.67 24.19,8.3 29.27,8.3 29.9,7.67 29.9,1.95 23.55,1.95
  pour Bottom (no thermals): 23.55,7.67 24.19,8.3 29.27,8.3 29.9,7.67 29.9,1.95 23.55,1.95
  pour Top (no thermals): 33.71,1.83 40.19,1.83 40.19,7.67 39.68,8.3 34.09,8.3 33.58,7.67 33.58,1.95
  pour Bottom (no thermals): 33.58,7.67 33.58,1.95 33.71,1.83 40.06,1.83 40.06,5.76 40.19,5.89 40.19,7.67 39.68,8.3 34.09,8.3
  pour Bottom (rank 3, no thermals): 0.25,101.35 101.35,101.35 101.35,8.13 48.01,8.13 47.5,8.64 41.66,8.64 40.89,7.87 40.39,7.87 39.62,7.11 24.13,7.11 23.37,7.87 22.61,7.87 21.84,8.64 16.26,8.64 15.75,8.13 0.25,8.13
  pour Top (no thermals): 49.7,50.36 51.81,50.36 51.81,52.53 55.08,52.53 55.08,50.29 57.16,50.29 57.16,49.96 55.08,49.96 55.08,42.86 51.78,42.86 51.78,49.89 49.7,49.89
ARM_TORPEDO  (via drill 0.35)  (2 unrouted)
  Top 0.152: R1.2 43.29,15.18 v43.29,15.29 | v45.42,15.26 45.42,16.84 46.52,17.94 46.52,19.38 46.51,19.39 46.51,21.68 54.6,29.77 55.73,29.77 60.1,34.14 60.1,45.18 65.48,50.55 65.48,58.81 65.84,59.17 84.38,59.17 89.12,59.17 v89.22,59.27 | CHARGING.A 59.27,91.31 83.28,67.3 v89.22,67.3
  Bottom 0.152: v43.29,15.29 45.39,15.29 v45.42,15.26 | U$9.P$18 89.2,59.24 v89.22,59.27
COIL_1  (via drill 1.5)
  Top 1.5: D5.A 22.96,80.08 TORPEDO_CONNECTOR.7 | v35.1,80 U$8.2
  Bottom 1.3: 26.6,79.6 Q7.3 27.43,79.57 | 30,79.57 Q4.3 30.83,79.54
  Bottom 1.5: TORPEDO_CONNECTOR.7 23.21,81.54 25.15,79.6 26.6,79.6 | v35.1,80 34.64,79.54 30.83,79.54 | 30,79.57 27.43,79.57
COIL_1_GATE  (via drill 0.35)  (1 unrouted)
  Top 0.152: v32.62,78.03 33.49,77.15 33.49,70.27 37.65,66.11 v75.45,66.11
  Bottom 0.152: Q7.1 28.65,78.6 30.61,78.6 Q4.1 31.52,78.03 v32.62,78.03 | v32.62,78.03 | U$9.P$4 75.45,52.4 v75.45,66.11
COIL_2
  Top 1.5: D7.A 25.96,83.72 23.51,83.72 TORPEDO_CONNECTOR.8
  Bottom 1.5: TORPEDO_CONNECTOR.8 22.89,85.73 25.35,83.27 26.57,83.27 Q8.3 27.33,83.37 30.06,83.37 Q14.3 30.78,83.33 35.13,83.33 U$7.2
COIL_2_GATE  (via drill 0.35)  (1 unrouted)
  Top 0.152: v32.65,81.77 32.65,79.03 33.77,77.91 33.77,70.75 37.51,67.02 72.65,67.02 72.7,66.97 v78.98,66.97 | R24.1 71.17,70.33
  Bottom 0.152: Q8.1 28.72,82.37 30.59,82.37 Q14.1 31.6,81.86 32.55,81.86 v32.65,81.77 | 79.05,56.44 U$9.P$14 79.04,66.91 v78.98,66.97
COIL_3  (via drill 1.5)
  Top 1.5: D3.A 25.74,72.48 22.18,72.48 TORPEDO_CONNECTOR.5 | U$5.2 38.41,75 v35.9,72.5
  Bottom 1.3: 26.74,72.24 Q9.3 27.23,72.27 | 30.18,72.27 Q5.3 30.66,72.24
  Bottom 1.5: TORPEDO_CONNECTOR.5 22.42,72.24 26.74,72.24 | 30.18,72.27 27.23,72.27 | 30.66,72.24 35.64,72.24 v35.9,72.5
COIL_3_GATE  (via drill 0.35)  (1 unrouted)
  Top 0.152: v35.67,70.39 36.07,70 36.07,69.37 37.62,67.82 v72.31,67.82
  Bottom 0.152: Q9.1 28.85,71.3 30.44,71.3 Q5.1 v35.67,70.39 | U$9.P$5 72.31,52.99 v72.31,67.82
COIL_4
  Top 1.5: D4.A 26.06,76.32 22.53,76.32 TORPEDO_CONNECTOR.6
  Bottom 1.3: 26.87,76.17 Q13.3 27.14,76.17 | 30.27,76.17 Q10.3 30.7,76
  Bottom 1.5: TORPEDO_CONNECTOR.6 22.92,77.35 24.09,76.17 26.87,76.17 | 30.27,76.17 27.14,76.17 | U$4.2 35.41,76 30.7,76
COIL_4_GATE  (via drill 0.35)  (1 unrouted)
  Top 0.152: v32.78,74.43 32.78,70.14 37.69,65.23 81.47,65.23 v81.49,65.26
  Bottom 0.152: Q13.1 28.81,75.07 30.48,75.07 Q10.1 31.61,74.46 32.74,74.46 v32.78,74.43 | U$9.P$15 81.58,65.17 v81.49,65.26
DROPPER1  (via drill 0.8)
  Top 0.8: 43.14,37.53 D8.A 42.8,37.56 40.95,37.56 v40.74,37.37 | 43.14,37.53 | 43.14,37.53 44.15,37.53 45.08,36.6 46.58,36.6 46.72,36.74 Q17.3
  Bottom 0.8: v40.74,37.37 40.22,37.37 39.33,38.26 23.66,38.26 22.52,37.11 18.25,37.11 MARKER_DROPPER.1
DROPPER1_GATE  (via drill 0.35)  (1 unrouted)
  Top 0.152: Q17.1 47.67,41.57 46.93,42.43 46.93,43.58 44.28,46.23 44.28,60.48 46.33,62.52 77.7,62.52 v77.86,62.69 | R21.1 68.85,70.33
  Bottom 0.152: U$9.P$3 77.86,52.52 v77.86,62.69
DROPPER2  (via drill 0.8)
  Top 0.8: Q12.3 44.24,41.14 43.71,41.67 D9.A 40.74,39.67 v40.74,38.97
  Bottom 0.8: v40.74,38.97 39.99,38.97 39.68,39.27 23.09,39.27 22.93,39.11 MARKER_DROPPER.3
DROPPER2_GATE  (via drill 0.35)  (1 unrouted)
  Top 0.152: Q12.1 47.67,43.27 44.86,46.09 44.86,60.22 46.39,61.75 76.39,61.75 v76.47,61.83 | R22.1 66.67,70.2
  Bottom 0.152: U$9.P$13 76.5,61.81 v76.47,61.83
MOTOR_EN  (via drill 0.35)  (1 unrouted)
  Top 0.152: v66.54,58.41 66.73,58.6 83.85,58.6 v84.04,58.41 | v55.89,59.42 55.43,59.88 49.84,59.88 48.95,58.99 48.95,51.54
  Bottom 0.152: v55.89,59.42 56.33,59.86 65.09,59.86 v66.54,58.41 | U$9.P$16 84.12,58.33 v84.04,58.41
  pour Top (no thermals): 51.48,48.7 51.48,49.1 49.36,49.1 49.36,51.15 51.45,51.15 51.45,51.68 47.95,51.68 47.95,48.7
N$2
  pour Top (no thermals): 55.37,51.08 57.55,51.08 57.88,51.41 57.88,53.29 59.17,53.29 59.17,51.18 58.51,51.18 57.92,50.59 55.37,50.59
N$3
  Top 0.152: R2.1 32.95,18.64 U$6.P$3
N$4
  Top 0.35: CHARGING.C R14.2
N$5
  Top 0.152: Q19.1 39.19,9.65 R1.1
N$6
  Top 0.152: Q19.2 33.78,10.04 33.78,9.2 33.62,9.04 30.99,9.04 30.31,9.72 R5.1
  Top 0.8: R5.1 27.73,10.31 27.53,10.31 26.21,11.63 Q20.1
N$7  (via drill 1)
  Top 1: v25.82,10.01 25.35,9.53 Q20.3 | R2.2 32.6,10.17 v31.47,10.17
  Bottom 1: v31.47,10.17 31.3,10.01 v25.82,10.01
N$10
  Top 0.152: POWER_IN.A 15.83,10.49 R20.1
N$15
  Top 1.3: R17.2 DISCHARGING.C
N$26
  Top 1.5: C5.1 41.12,24.45
  Top 2: 41.12,24.45 41.12,19.23 U$6.P$6 | 120.P$1 40.25,25.33 C5.1
N$33  (via drill 0.35)
  Top 0.152: v28.12,64.1 27.96,63.94 27.96,63.81 27.96,62.98 Q18.1 | v34.8,64.33 35.12,64.01 35.12,63.44 R43.1 34.92,58.55 35.98,57.5 R44.2
  Bottom 0.152: v34.8,64.33 34.8,64.43 28.46,64.43 v28.12,64.1
N$34
  Top 0.152: R44.1 41.59,55.63 41.59,51.71 40.28,50.39 Q2.3
N$35  (via drill 0.35)
  Top 0.152: R12.2 37.94,54.69 35.02,54.69 R9.1 35.27,54.94 35.27,55.8 v34.97,56.1 | v27.79,55.74 27.63,55.57 27.63,55.02 Q6.1
  Bottom 0.152: v34.97,56.1 34.67,55.8 27.86,55.8 v27.79,55.74
N$36
  Top 0.152: R12.1 40,54.66 41.23,53.43 41.23,51.75 39.82,50.34 38.71,49.23 36.2,49.23 Q3.3
N$45
  Top 0.152: 50.62,47.53 U1.8
  pour Top (no thermals): 49.76,47.71 51.48,47.71 51.48,44.44 49.73,44.44 49.73,47.68
N$48
  pour Top (no thermals): 55.37,49.03 58.61,49.03 58.84,49.27 60.62,49.27 60.62,48.04 58.74,48.04 58.15,48.64 55.37,48.64
N$49
  Top 0.152: U1.12
  pour Top (no thermals): 55.37,49.66 57.49,49.66 58.71,50.88 60.62,50.88 60.62,49.66 58.74,49.66 58.41,49.33 55.37,49.33
PWM_DRIVER1  (via drill 0.35)  (1 unrouted)
  Top 0.152: 50.61,50.78 U1.3 49.41,50.77 v49.4,50.75 | v48.24,53.16 48.24,59.37 49.73,60.86 90.22,60.86 v90.34,60.98
  Bottom 0.152: v49.4,50.75 48.24,51.91 v48.24,53.16 | U$9.P$9 90.34,52.74 v90.34,60.98
PWM_DRIVER2  (via drill 0.35)  (1 unrouted)
  Top 0.152: 56.23,52.09 U1.16 56.23,58.69 57.78,60.25 71.44,60.25 71.56,60.12 v91.7,60.12
  Bottom 0.152: U$9.P$19 91.74,60.08 v91.7,60.12
PWM_OUT1  (via drill 0.8)
  Top 0.8: v40.85,33.38 47.62,33.38 48.74,34.51 48.74,44.54 48.57,44.71 | v24.6,30.88 24.6,30.6 22.18,28.18 20.95,28.18 19.08,26.3 CLAW_CONTROL.1
  Bottom 0.8: v40.85,33.38 40.78,33.32 27.33,33.32 24.9,30.88 v24.6,30.88
  pour Top (no thermals): 51.48,48.01 49.56,48.01 49.43,47.88 49.43,44.44 47.81,44.44 47.81,48.01 48.21,48.41 51.48,48.41
PWM_OUT2  (via drill 0.8)
  Top 0.8: v26.18,30.28 25.86,30.28 21.88,26.3 CLAW_CONTROL.3 | 59.3,44.74 59.3,34.49 55.31,30.5 v43.45,30.5
  Bottom 0.8: v26.18,30.28 26.18,30.31 26.45,30.58 43.37,30.58 v43.45,30.5
  pour Top (no thermals): 55.37,48.31 58.02,48.31 58.58,47.75 59.73,47.75 59.73,44.44 57.72,44.44 57.72,47.91 57.62,48.01 55.37,48.01
SCL  (via drill 0.35)
  Top 0.152: U$1.31 80.08,7.42 86.12,13.46 86.12,46.82 v86.64,47.33 | v86.64,47.33
  Bottom 0.152: v86.64,47.33 87.79,48.49 87.79,55.29 U$9.P$17
SDA  (via drill 0.35)
  Top 0.152: U$1.32 77.54,5.3 85.83,13.59 85.83,47.53 v86.64,48.34 | v86.64,48.34
  Bottom 0.152: v86.64,48.34 86.64,51.34 U$9.P$7
TORPEDO1
  Top 1.5: TORPEDO_CONNECTOR.1 15.99,70.39 20.73,65.65 Q18.3
TORPEDO1_GATE  (via drill 0.35)  (1 unrouted)
  Top 0.152: Q2.1 39.98,47.44 40.71,48.16 42.04,48.16 43.24,49.37 43.24,61.16 46.41,64.33 80.59,64.33 v80.67,64.4
  Bottom 0.152: U$9.P$2 81.58,54.03 80.8,54.81 80.8,64.27 v80.67,64.4
TORPEDO2
  Top 1.5: Q6.3 20.73,56.95 12.52,65.16 12.52,75.37 14.5,77.35 TORPEDO_CONNECTOR.2
TORPEDO2_GATE  (via drill 0.35)  (1 unrouted)
  Top 0.152: Q3.1 35.55,47.49 37.13,45.9 41,45.9 43.76,48.66 43.76,60.81 46.38,63.43 73.85,63.43 v73.97,63.55 | R19.1 67.45,74.28
  Bottom 0.152: U$9.P$12 73.96,63.54 v73.97,63.55
V+
  Top 0.8: Q20.2 22.45,11.63 22.39,11.56 20.83,11.56 R20.2
  pour Top (no thermals): 20.34,19.71 31.44,19.71 31.47,19.68 31.47,13.31 28.86,10.7 22.92,10.7 20.31,13.31 20.31,19.68
V_DIV  (via drill 0.35)
  Top 0.152: R10.2 69.74,35.1 | 69.74,35.1 R11.1 | v88.69,49.03 86.95,49.03 86.37,49.62 71.03,49.62 70.59,49.17 70.59,35.95 69.74,35.1
  Bottom 0.152: v88.69,49.03 89.2,49.54 U$9.P$8

### Text on the board
tPlace: Illustrated By: Isabella Richardson, 2021 | The Underwater Robotics / Team | Actuator Board
tNames: COIL_S | COIL_2 | COIL_5 | COIL_1 | TORP_2 | COIL_4 | TORP_1 | COIL_3 | 5V | 5V | DROPPER1 | DROPPER2 | PWM_OUT1 | PWM_OUT2 | +12V | V+ | GND | GND